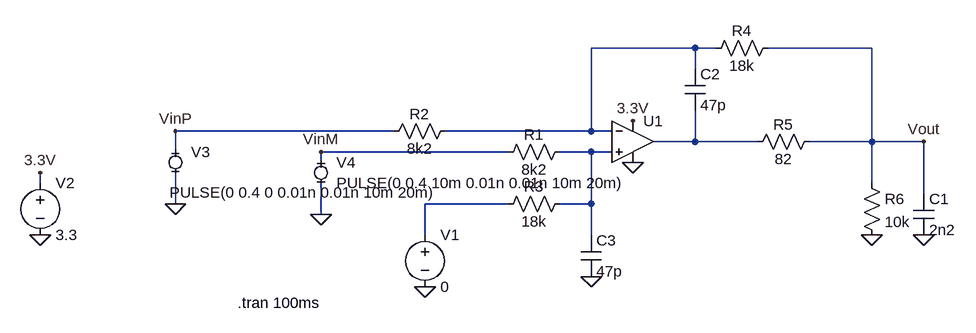
[diagram p0: schematic AnalogIn.asc]
AnalogIn.asc, the LTspice schematic file:
Version 4
SHEET 1 880 680
WIRE 368 -64 208 -64
WIRE 400 -64 368 -64
WIRE 640 -64 480 -64
WIRE 368 -32 368 -64
WIRE -96 64 -432 64
WIRE 208 64 208 -64
WIRE 208 64 -16 64
WIRE 240 64 208 64
WIRE 368 80 368 32
WIRE 368 80 304 80
WIRE 464 80 368 80
WIRE 640 80 640 -64
WIRE 640 80 544 80
WIRE 720 80 640 80
WIRE -432 96 -432 64
WIRE 80 96 -208 96
WIRE 208 96 160 96
WIRE 240 96 208 96
WIRE -208 112 -208 96
WIRE -640 144 -640 128
WIRE 640 144 640 80
WIRE 720 160 720 80
WIRE -432 176 -432 128
WIRE 80 176 -48 176
WIRE 208 176 208 96
WIRE 208 176 160 176
WIRE -208 192 -208 144
WIRE -48 224 -48 176
WIRE 208 224 208 176
FLAG -48 304 0
FLAG 272 112 0
FLAG -640 224 0
FLAG 272 48 3.3V
FLAG -640 128 3.3V
FLAG 208 288 0
FLAG 640 224 0
FLAG 720 224 0
FLAG -208 192 0
FLAG -432 176 0
FLAG -432 64 VinP
FLAG -208 96 VinM
FLAG 720 80 Vout
SYMBOL res 176 80 R90
WINDOW 0 5 56 VBottom 2
WINDOW 3 27 56 VTop 2
SYMATTR InstName R1
SYMATTR Value 8k2
SYMBOL Opamps\\UniversalOpamp2 272 80 R0
SYMATTR InstName U1
SYMBOL res 0 48 R90
WINDOW 0 5 56 VBottom 2
WINDOW 3 27 56 VTop 2
SYMATTR InstName R2
SYMATTR Value 8k2
SYMBOL res 176 160 R90
WINDOW 0 5 56 VBottom 2
WINDOW 3 27 56 VTop 2
SYMATTR InstName R3
SYMATTR Value 18k
SYMBOL res 496 -80 R90
WINDOW 0 5 56 VBottom 2
WINDOW 3 27 56 VTop 2
SYMATTR InstName R4
SYMATTR Value 18k
SYMBOL res 560 64 R90
WINDOW 0 5 56 VBottom 2
WINDOW 3 27 56 VTop 2
SYMATTR InstName R5
SYMATTR Value 82
SYMBOL res 624 128 R0
SYMATTR InstName R6
SYMATTR Value 10k
SYMBOL cap 704 160 R0
SYMATTR InstName C1
SYMATTR Value 2n2
SYMBOL cap 352 -32 R0
SYMATTR InstName C2
SYMATTR Value 47p
SYMBOL cap 192 224 R0
SYMATTR InstName C3
SYMATTR Value 47p
SYMBOL voltage -48 208 R0
WINDOW 123 0 0 Left 2
WINDOW 39 0 0 Left 2
SYMATTR InstName V1
SYMATTR Value 0
SYMBOL voltage -640 128 R0
WINDOW 123 0 0 Left 2
WINDOW 39 0 0 Left 2
SYMATTR InstName V2
SYMATTR Value 3.3
SYMBOL MiniSyms4\\voltage- -432 112 R0
WINDOW 123 0 0 Left 2
WINDOW 39 0 0 Left 2
WINDOW 3 -9 46 Left 2
SYMATTR InstName V3
SYMATTR Value PULSE(0 0.4 0 0.01n 0.01n 10m 20m)
SYMBOL MiniSyms4\\voltage- -208 128 R0
WINDOW 123 0 0 Left 2
WINDOW 39 0 0 Left 2
SYMATTR InstName V4
SYMATTR Value PULSE(0 0.4 10m 0.01n 0.01n 10m 20m)
TEXT -336 328 Left 2 !.tran 100ms

The netlist it stands for:
* AnalogIn.asc
R1 N003 VinM 8k2
XU1 N003 N001 3.3V 0 N002 level.2 Avol=1Meg GBW=10Meg Slew=10Meg ilimit=25m rail=0 Vos=0 phimargin=45 en=0 enk=0 in=0 ink=0 Rin=500Meg  ; pins IN+ IN- V+ V- OUT
R2 N001 VinP 8k2
R3 N003 N004 18k
R4 Vout N001 18k
R5 Vout N002 82
R6 Vout 0 10k
C1 Vout 0 2n2
C2 N001 N002 47p
C3 N003 0 47p
V1 N004 0 0
V2 3.3V 0 3.3
V3 VinP 0 PULSE(0 0.4 0 0.01n 0.01n 10m 20m)
V4 VinM 0 PULSE(0 0.4 10m 0.01n 0.01n 10m 20m)
.tran 100ms
.lib UniversalOpamps2.sub
.backanno
.end